# Altium schematic sheet OCP.SchDoc: =DocumentName
size A4; CompanyName: "AS Manufacturing" LLC; Organization: "AS Manufacturing" LLC; Address1: 5 Sklyarenka St.; Address2: Kyiv 04073; Address3: Ukraine; Address4: https://ajax.systems/en/; SheetNumber: 7; SheetTotal: 10; Template_version: 1.0.1
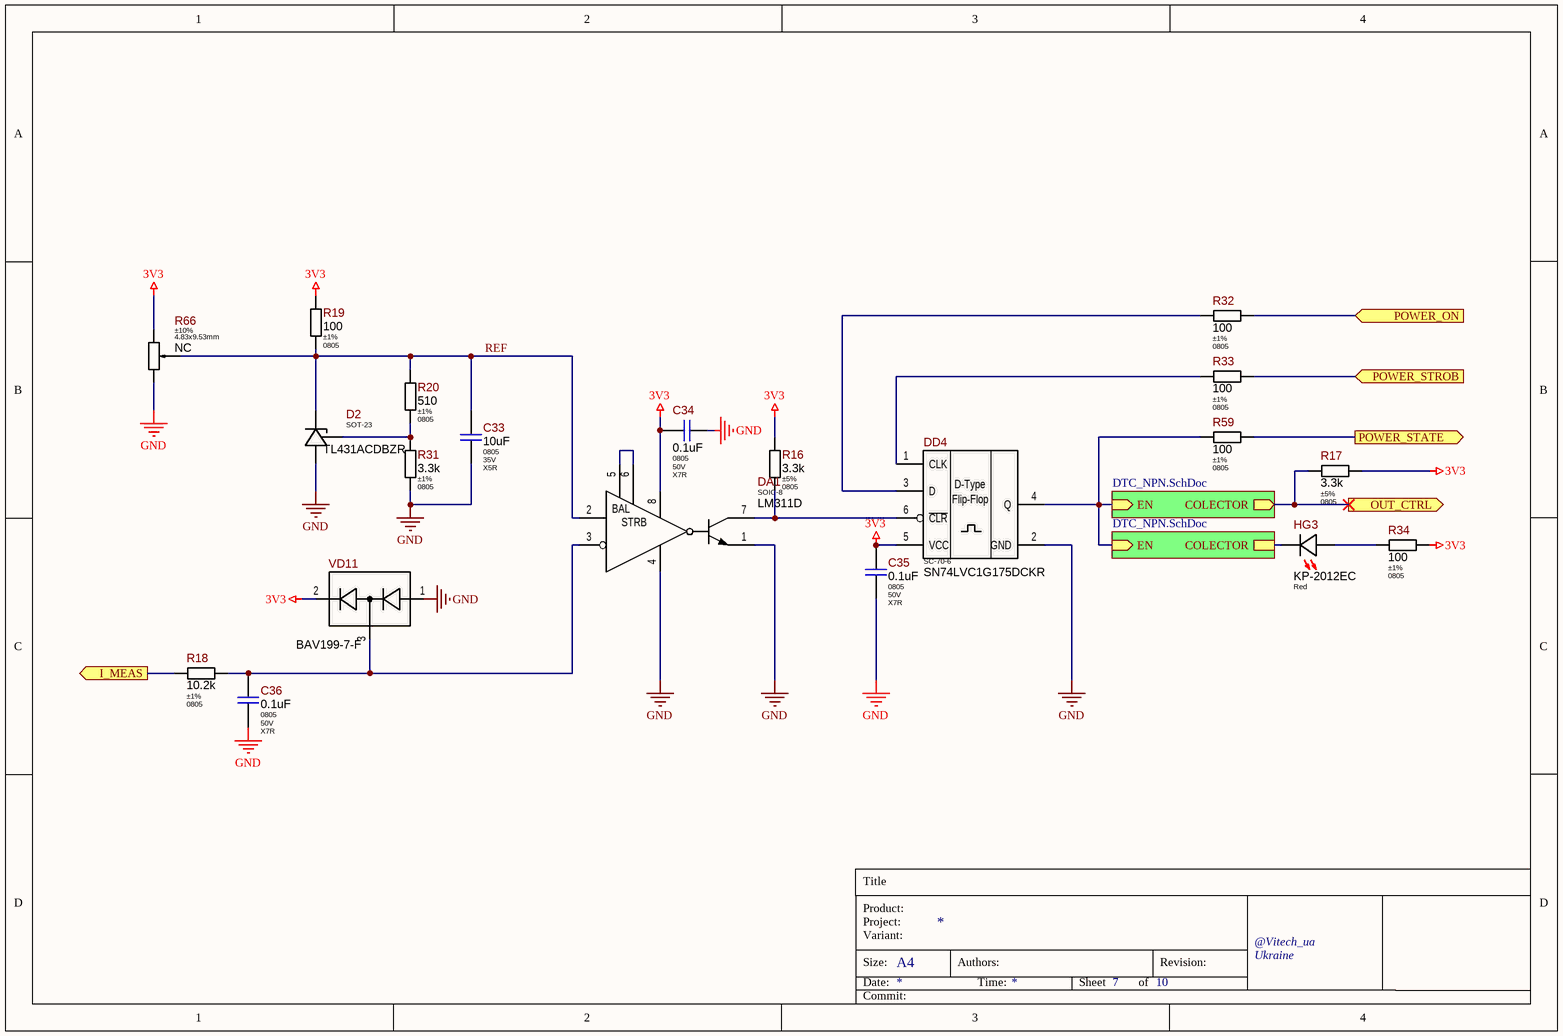
[diagram p0: OCP.SchDoc]

## Parts
C33  Package: 0805  Voltage: 35V  Dielectric Type: X5R  [CAP-0805(2012)X125T20]  (hidden comment: 10uF)
C34  Package: 0805  Voltage: 50V  Dielectric Type: X7R  [CAP-0805(2012)X85T10]  (hidden comment: 0.1uF)
C35  Package: 0805  Voltage: 50V  Dielectric Type: X7R  [CAP-0805(2012)X85T10]  (hidden comment: 0.1uF)
C36  Package: 0805  Voltage: 50V  Dielectric Type: X7R  [CAP-0805(2012)X85T10]  (hidden comment: 0.1uF)
D2  Package: SOT-23  [SOT-23_MED]  (hidden comment: TL431ACDBZR)
DA1  Package: SOIC-8  [SOIC-8_W3.9MM]  (hidden comment: LM311D)
DD4  SN74LVC1G175DCKR  [SC-70-6]
HG3  Color: Red  [KP-2012EC]  (hidden comment: KP-2012EC)
R16  Tolerance: ±5%  Package: 0805  [R_ANY_CHIP_0805_MED]  (hidden comment: 3.3k)
R17  Tolerance: ±5%  Package: 0805  [R_ANY_CHIP_0805_MED]  (hidden comment: 3.3k)
R18  Tolerance: ±1%  Package: 0805  [R_ANY_CHIP_0805_MED]  (hidden comment: 10.2k)
R19  Tolerance: ±1%  Package: 0805  [R_ANY_CHIP_0805_MED]  (hidden comment: 100)
R20  Tolerance: ±1%  Package: 0805  [R_ANY_CHIP_0805_MED]  (hidden comment: 510)
R31  Tolerance: ±1%  Package: 0805  [R_ANY_CHIP_0805_MED]  (hidden comment: 3.3k)
R32  Tolerance: ±1%  Package: 0805  [R_ANY_CHIP_0805_MED]  (hidden comment: 100)
R33  Tolerance: ±1%  Package: 0805  [R_ANY_CHIP_0805_MED]  (hidden comment: 100)
R34  Tolerance: ±1%  Package: 0805  [R_ANY_CHIP_0805_MED]  (hidden comment: 100)
R59  Tolerance: ±1%  Package: 0805  [R_ANY_CHIP_0805_MED]  (hidden comment: 100)
R66  Tolerance: ±10%  Package: 4.83x9.53mm  [3296W-1-xxx]  (hidden comment: NC)
VD11  BAV199-7-F  [SOT-23_MED]

## Sub-sheets
OC = DTC_NPN.SchDoc: EN (in), COLECTOR (out)
OC = DTC_NPN.SchDoc: EN (in), COLECTOR

## Ports
I_MEAS (out), OUT_CTRL (out), POWER_ON (in), POWER_STATE (out), POWER_STROB (in)

## Nets
3V3: C34.1 C35.1 DA1.8(VCC) DD4.5(VCC) R16.1 R17.1 R19.1 R34.2 R66.1(CCW) VD11.2
GND: C33.2 C34.2 C35.2 C36.2 D2.3(A) DA1.1(EMIT_OUT) DA1.4(GND) DD4.2(GND) R31.2 R66.3(CW) VD11.1
I_MEAS: R18.2 ; port I_MEAS
OUT_CTRL: R17.2 ; port OUT_CTRL, sheet OC/COLECTOR
POWER_ON: R32.2 ; port POWER_ON
POWER_STATE: R59.2 ; port POWER_STATE
POWER_STROB: R33.2 ; port POWER_STROB
REF: C33.1 D2.1(C) DA1.2(IN+) R19.2 R20.1 R66.2(WIPER)
NetC36_1: C36.1 DA1.3(IN-) R18.1 VD11.3
NetD2_2: D2.2(REF) R20.2 R31.1
NetDA1_5: DA1.5(BALANCE) DA1.6(BAL/STRB)
NetDA1_7: DA1.7(COL_OUT) DD4.6(~{CLR}) R16.2
NetDD4_1: DD4.1(CLK) R33.1
NetDD4_3: DD4.3(D) R32.1
NetDD4_4: DD4.4(Q) R59.1 ; sheet OC/EN, sheet OC/EN
NetHG3_AN: HG3.AN(Anode) R34.1
NetHG3_CA: HG3.CA(Cathode) ; sheet OC/COLECTOR

## Notes on the sheet
- Title
- Product:
- Project:
- Size:
- Date:
- Variant:
- A4
- Authors:
- Time:
- Sheet
- of
- Revision:
- @Vitech_ua
- Commit:
- (in symbol LM311D) BAL; STRB
- (in symbol SN74LVC1G175DCKR) D-Type; Flip-Flop

## Library data of the parts
C33 = C2012X5R1V106K125AC: 10uF 35V X5R ±10% 0805 Low ESL Ceramic Capacitor RoHS; Manufacturer: TDK Corporation; Ajax_1C_ID: 29369; Ajax_1C_PN: 10uF 35V X5R 10% 0805 C2012X5R1V106K125AC TDK Ceramic Capacitor SMD RoHS; Ajax_1С_Status: Substitution; Standard Lead Time: 28 Weeks; Component Status: Released; Replacement: NONE; GUID_1C: b7f6aaac-a81d-11eb-ab74-0050569f2651; Value: 10uF; Part Number: C2012X5R1V106K125AC; Part Type: Ceramic / X5R / 0805; Component Type: SMD; Temperature Range: -55°C ~ 85°C; Tolerance: ±10%; ComponentLink1URL: https://product.tdk.com/system/files/dam/doc/product/capacitor/ceramic/mlcc/catalog/mlcc_commercial_general_en.pdf; Supplier 1: Digi-Key; Supplier Part Number 1: 445-14418-2-ND; Price: 0,04568564; ComponentLink1Description: Datasheet
C34-C36 = CL21B104KBCNNNC: 100nF 50V X7R ±10% 0805 Ceramic Capacitor RoHS; Manufacturer: Samsung Electro-Mechanics; Ajax_1C_ID: 1251; Ajax_1C_PN: 100nF 50V X7R 10% 0805 CL21B104KBCNNNC Ceramic Capacitor SMD RoHS; Ajax_1С_Status: Mass Production; Standard Lead Time: 22 Weeks; Component Status: Released; Replacement: NONE; GUID_1C: 2c368b99-dd41-11e0-af93-6c626deda1bb; Value: 0.1uF; Part Number: CL21B104KBCNNNC; Part Type: Ceramic / X7R / 0805; Component Type: SMD; Temperature Range: -55°C ~ 125°C; Tolerance: ±10%; ComponentLink1URL: https://media.digikey.com/pdf/Data%20Sheets/Samsung%20PDFs/CL_Series_MLCC_ds.pdf; Supplier 1: Digi-Key; Supplier Part Number 1: 1276-1003-2-ND; Price: 0,00700031; ComponentLink1Description: Datasheet
D2 = TL431ACDBZR: Adjustable Precision Shunt Regulator, Accuracy 1%,  SOT-23-3; Manufacturer: Texas Instruments; Ajax_1C_ID: 6287; Ajax_1C_PN: TL431ACDBZR (SOT-23); Ajax_1С_Status: Mass Production; Standard Lead Time: 8 Weeks; Component Status: Released; Replacement: NONE; GUID_1C: b426e85d-df70-11e4-9f89-a45d36c4a9e5; Part Number: TL431ACDBZR; Part Type: Voltage Reference; Component Type: SMD; Temperature Range: 0°C ~ 70°C; ComponentLink1URL: https://www.ti.com/lit/ds/symlink/tl431.pdf; Supplier 1: Digi-Key; Supplier Part Number 1: 296-17328-1-ND; Price: 0,0553; ComponentLink1Description: Datasheet
DA1 = LM311D: Differential General Purpose Comparator with Open-Collector, Open-Emitter, SOIC-8; Manufacturer: Texas Instruments; Ajax_1C_ID: 11065; Ajax_1C_PN: LM311D SO8, микросхема; Ajax_1С_Status: RND Only; Standard Lead Time: 6 Weeks; Component Status: On Review; Replacement: NONE; GUID_1C: 9c0f62f0-bfd1-11e7-8199-14dda9d2d04d; Part Number: LM311D; Part Type: Comparator; Component Type: SMD; Temperature Range: 0°C ~ 70°C; ComponentLink1URL: https://www.ti.com/lit/ds/symlink/lm311.pdf; Supplier 1: Digi-Key; Supplier Part Number 1: 296-1388-5-ND; Price: 0,2625203; ComponentLink1Description: Datasheet
DD4 = SN74LVC1G175DCKR: Single D-type Flip-Flop with Asynchronous Clear, Positive Edge Trigger, SC-70-6; Manufacturer: Texas Instruments; Ajax_1C_ID: 25389; Ajax_1C_PN: SN74LVC1G175DCKR (SC70-6) микросхема; Ajax_1С_Status: RND Only; Standard Lead Time: 6 Weeks; Component Status: On Review; Replacement: NONE; GUID_1C: 0fcd2c69-53fe-11eb-ab6e-0050569f2651; Package: SC-70-6; Part Number: SN74LVC1G175DCKR; Part Type: Logic / Flip-Flop; Component Type: SMD; Temperature Range: -40°C ~ 125°C; ComponentLink1URL: https://www.ti.com/lit/ds/symlink/sn74lvc1g175.pdf; Supplier 1: Digi-Key; Supplier Part Number 1: 296-16998-2-ND; Price: 0,0382; ComponentLink1Description: Datasheet
HG3 = KP-2012EC: Low Power LED, Red 617nm, SMD, Vf 2V, 15mcd @ 20 mA, 160°; Manufacturer: Kingbright; Ajax_1C_ID: 1424; Ajax_1C_PN: Светодиоды 0805 SMD красные / KP-2012EC / BL-HS135A-AV-TRB; Ajax_1С_Status: Mass Production; Component Status: Released; Replacement: NONE; GUID_1C: 254df8b6-dd50-11e0-af93-6c626deda1bb; Part Number: KP-2012EC; Part Type: LED / 0805; Component Type: SMD; Package: 0805; Wavelength: 617nm; Temperature Range: -40°C ~ 85°C; ComponentLink1URL: \\altiumdb.ajax.local\files\Datasheet\Opto\KP-2012EC.pdf; Supplier 1: Farnell; Supplier Part Number 1: 8529949; Price: 0,02786; ComponentLink1Description: Datasheet
R16 R17 R31 = RC0805JR-073K3L: 3.3 kOhms ±5%, 1/8W 0805 Thick Film Resistor; Manufacturer: Yageo; Ajax_1C_ID: 9030; Ajax_1C_PN: 3.3k 5% 0805 Resistors SMD RoHS; Ajax_1С_Status: RND Only; Power Rating: 0.125W; Voltage: 150V; Component Status: Released; Temperature Stability: ±100ppm/°C; Replacement: NONE; GUID_1C: cb9785ec-9b47-11e6-8242-d8cb8a9acc66; Value: 3.3k; Part Number: RC0805JR-073K3L; Component Type: SMD; Part Type: Thick Film; Temperature Range: -55°C ~ 155°C; ComponentLink1URL: https://eu.mouser.com/datasheet/2/447/PYu_RC_Group_51_RoHS_L_10-1664068.pdf; Price: 0,001081; ComponentLink1Description: Datasheet
R18 = RC0805FR-0710K2L: 10.2 kOhms ±1%, 1/8W 0805 Thick Film Resistor; Manufacturer: Yageo; Ajax_1C_ID: 13943; Ajax_1C_PN: 10.2k 1% 0805 Resistors SMD RoHS; Ajax_1С_Status: Mass Production; Power Rating: 0.125W; Voltage: 150V; Component Status: Released; Temperature Stability: ±100ppm/°C; Replacement: NONE; GUID_1C: 8bc9d0ce-c58a-11e8-ab47-0050569f2651; Value: 10.2k; Part Number: RC0805FR-0710K2L; Component Type: SMD; Part Type: Thick Film; Temperature Range: -55°C ~ 155°C; ComponentLink1URL: https://eu.mouser.com/datasheet/2/447/PYu_RC_Group_51_RoHS_L_10-1664068.pdf; Supplier 1: Digi-Key; Supplier Part Number 1: 311-10.2KCRTR-ND; Price: 0,0014; ComponentLink1Description: Datasheet
R19 R32-R34 R59 = RC0805JR-073K3L: 3.3 kOhms ±5%, 1/8W 0805 Thick Film Resistor; Part Number: RC0805JR-07100; Manufacturer: Yageo; Ajax_1C_ID: 9030; Ajax_1C_PN: 100 5% 0805 Resistors SMD RoHS; Ajax_1С_Status: RND Only; Power Rating: 0.125W; Voltage: 150V; Component Status: Released; Temperature Stability: ±100ppm/°C; Replacement: NONE; GUID_1C: cb9785ec-9b47-11e6-8242-d8cb8a9acc66; Value: 100; Component Type: SMD; Part Type: Thick Film; Temperature Range: -55°C ~ 155°C; ComponentLink1URL: https://eu.mouser.com/datasheet/2/447/PYu_RC_Group_51_RoHS_L_10-1664068.pdf; Price: 0,001081; ComponentLink1Description: Datasheet
R20 = CRCW0805510RJNEA: 510 Ohms ±5%, 1/8W 0805 Thick Film Resistor; Manufacturer: Vishay; Ajax_1C_ID: 9454; Ajax_1C_PN: 510R 5% 0805 Resistors SMD RoHS; Ajax_1С_Status: RND Only; Power Rating: 0.125W; Voltage: 150V; Component Status: Released; Temperature Stability: ±200ppm/°C; Replacement: NONE; GUID_1C: 51b8dd24-e3a6-11e6-82a2-d8cb8a9acc66; Value: 510; Part Number: CRCW0805510RJNEA; Component Type: SMD; Part Type: Thick Film; Temperature Range: -55°C ~ 155°C; ComponentLink1URL: https://eu.mouser.com/datasheet/2/427/dcrcwe3-1762152.pdf; Supplier 1: Mouser; Supplier Part Number 1: 71-CRCW0805510RJNEA; Price: 0,09; ComponentLink1Description: Datasheet
R66 = 3296W-1-103LF: 10 kOhms ±10% Trimmer Resistor, 0.5W, Through Hole 3/8", 4.83x9.53mm, 10.03mm Height; Manufacturer: Bourns; Ajax_1C_PN: NONE; Ajax_1С_Status: RND Only; Component Status: On Review; Temperature Stability: ±100ppm/°C; Value: NC; Part Number: 3296W-1-103LF; Component Type: PTH; Part Type: Trimming Potentiometer; Power Rating: 0.5W; Temperature Range: -55°C ~ 125°C; ComponentLink1URL: https://www.bourns.com/data/global/pdfs/3296.pdf; Supplier 1: Mouser; Supplier Part Number 1: 652-3296W-1-103LF; Replacement: NONE; Price: NONE; ComponentLink1Description: Datasheet
VD11 = BAV199-7-F: Diode Array 1 Pair Series Connection Standard 85V 160mA, 5nA Reverse Current, SOT-23; Manufacturer: Diodes Incorporated; Ajax_1C_ID: 25391; Ajax_1C_PN: BAV199-7-F (SOT-23) диод; Ajax_1С_Status: RND Only; Marking: K52; Component Status: Released; Standard Lead Time: 30 Weeks; Vf: 1.25V @ 150 mA; Replacement: NONE; GUID_1C: 0951ac93-5400-11eb-ab6e-0050569f2651; Voltage: 85V; Part Number: BAV199-7-F; Part Type: Array; Component Type: SMD; Package: SOT-23; Current: 160mA; Temperature Range: -65°C ~ 150°C; ComponentLink1URL: https://eu.mouser.com/datasheet/2/115/DIOD_S_A0008363444_1-2543096.pdf; Supplier 1: Mouser; Supplier Part Number 1: 621-BAV199-F; Price: 0,022; ComponentLink1Description: Datasheet